# EAGLE design main (EAGLE 6.1)
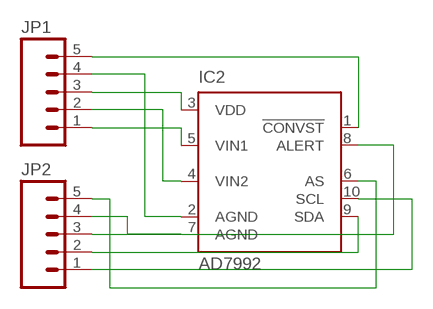
[diagram p0: schematic, sheet 1]

## Parts
IC2  AD7992  [MSOP10]
JP1  M05PTH_LONGPADS  [1X05_LONGPADS]
JP2  M05PTH_LONGPADS  [1X05_LONGPADS]

## Nets
N$1: IC2.1(!CONVST) JP1.5
N$2: IC2.2(AGND) JP1.4
N$3: IC2.3(VDD) JP1.3
N$4: IC2.4(VIN2) JP1.2
N$5: IC2.5(VIN1) JP1.1
N$6: IC2.6(AS) JP2.5
N$7: IC2.7(AGND) JP2.4
N$8: IC2.8(ALERT) JP2.3
N$10: IC2.9(SDA) JP2.2
N$11: IC2.10(SCL) JP2.1

## Library data of the parts
IC2 = analog-devices:AD7992: 2-Channel, 12-Bit ADC with I2C-Compatible Interface 10-Lead MSOP Source: http://www.analog.com/UploadedFiles/Data_Sheets/224965274AD7992_0.pdf; MPN: AD7992BRMZ-0; OC_FARNELL: 1078311; OC_NEWARK: 31M4422
JP1 JP2 = SparkFun:M05: Header 5 Standard 5-pin 0.1" header. Use with straight break away headers (SKU : PRT-00116), right angle break away headers (PRT-00553), swiss pins (PRT-00743), machine pins (PRT-00117), and female headers (PRT-00115). Molex polarized connector foot print use with SKU : PRT-08230 with associated crimp pins and housings.

## Board
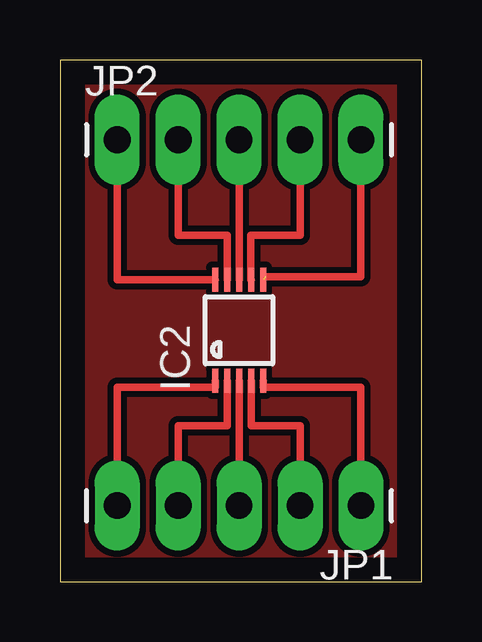
[diagram p1: board, top side]

Size 15.07 x 21.74 mm. Coordinates in mm from the lower left corner, seen from the top.
Outline: 0,0 15.07,0 15.07,21.74 0,21.74 0,0
Copper layers (1*16): Top 0.035mm / dielectric 1.5mm / Bottom 0.035mm
Design rules: minimum track width 10mil, minimum drill 24mil, track to track 8mil, track to pad 8mil, pad to pad 8mil, via to via 8mil, smd to smd 8mil, copper to edge 40mil, drill to drill 8mil, minimum pad ring 10mil, minimum via ring 8mil, stop-mask expansion 4mil, vias tented up to drill 0mil, thermal gap 10mil

### Footprints (pad centres in the part's own frame; a part is rotated, then mirrored left to right if it is on the bottom)
MSOP10 = smd 0.25 x 1: 1 -1,-2.113; 2 -0.5,-2.113; 3 0,-2.113; 4 0.5,-2.113; 5 1,-2.113; 6 1,2.113; 7 0.5,2.113; 8 0,2.113; 9 -0.5,2.113; 10 -1,2.113
1X05_LONGPADS = drill 1.118 pad 1.88 long: 1 0,0; 2 2.54,0; 3 5.08,0; 4 7.62,0; 5 10.16,0

### Placement (x,y rotation side)
IC2  7.46,10.48 0 top
JP1  12.54,3.18 180 top
JP2  2.38,18.41 0 top

### Tracks (layer width: path | path; a pad name or v marks a point on that pad's centre or on a via)
N$1
  Top 0.305: IC2.1 6.46,8.1 2.38,8.1 JP1.5
N$2
  Top 0.305: IC2.2 6.96,6.51 4.92,6.51 JP1.4
N$3
  Top 0.305: IC2.3 JP1.3
N$4
  Top 0.305: IC2.4 7.96,6.51 10,6.51 JP1.2
N$5
  Top 0.305: IC2.5 8.46,8.1 12.54,8.1 JP1.1
N$6  (1 unrouted)
  Top 0.305: JP2.5 12.54,12.7 8.57,12.7
N$7
  Top 0.305: JP2.4 10,14.45 7.94,14.45 7.94,12.59 IC2.7
N$8
  Top 0.305: JP2.3 IC2.8
N$9
  pour Top (isolate 0.254): 0,21.59 15.08,21.75 15.08,0 0,0
N$10
  Top 0.305: JP2.2 4.92,14.45 6.96,14.45 IC2.9
N$11
  Top 0.305: JP2.1 2.38,12.59 IC2.10